# Altium project WIoT-WiFi_Shield.PrjPcb
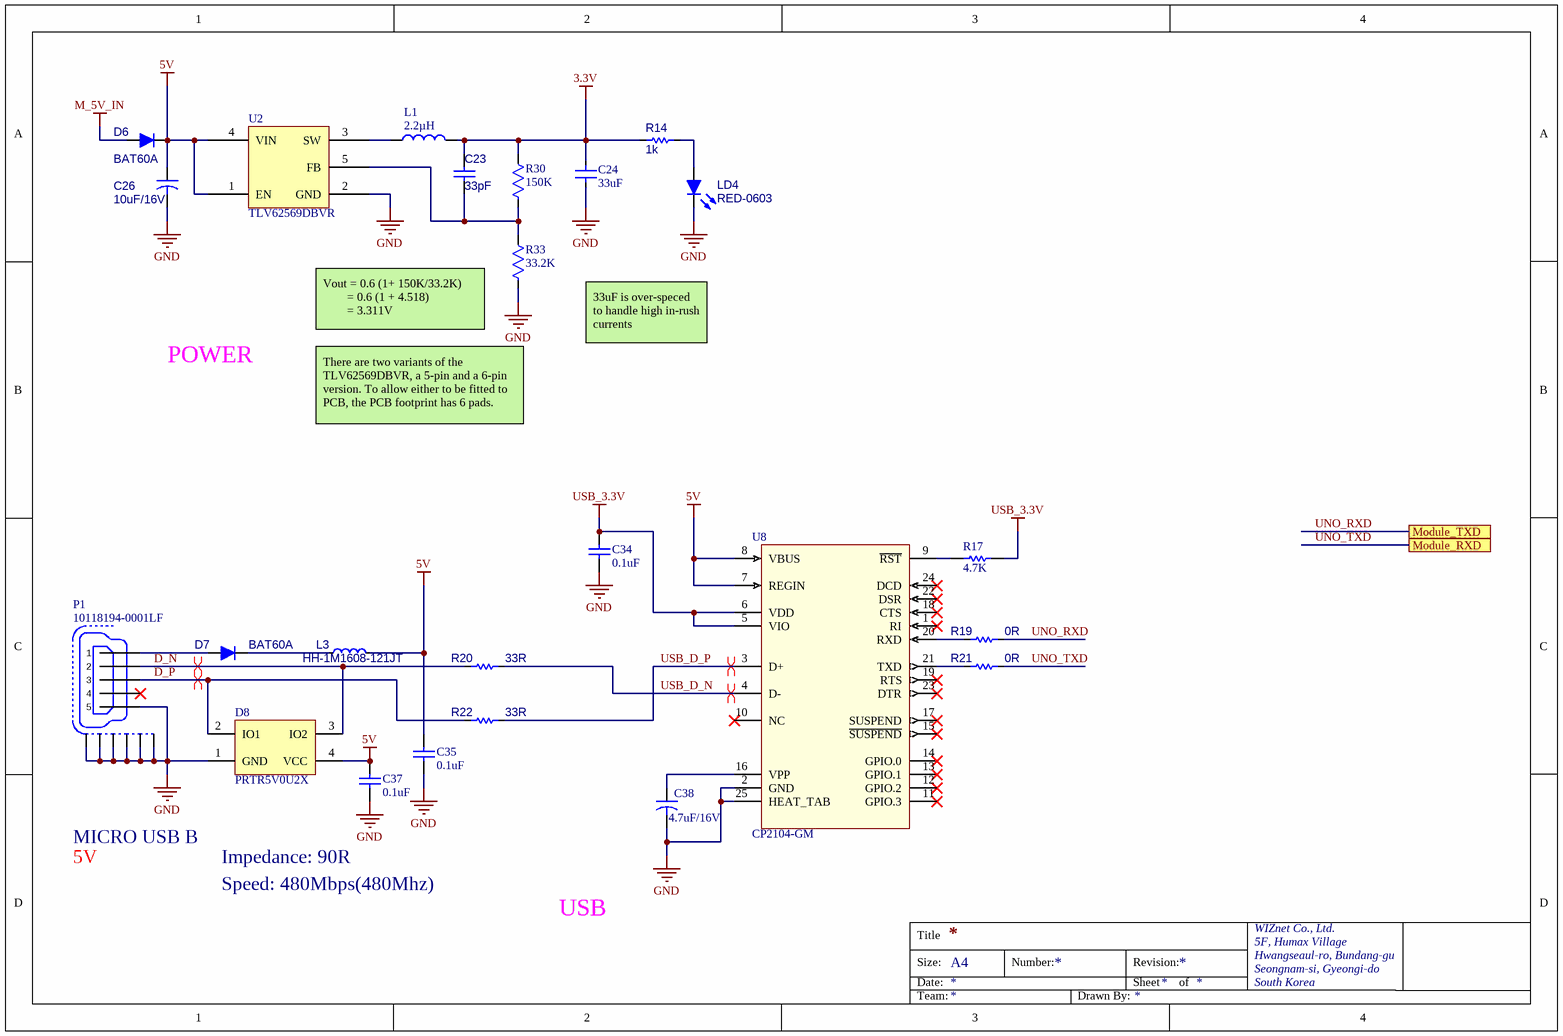
[diagram p0: 1.WiFi_POWER.SchDoc]
2 sheets, 55 parts. Net scope: flat (ports and power ports of the same name join across sheets).
Board file: WIoT-WiFi_shield.PcbDoc
Sheets:
  1.WiFi_POWER.SchDoc
  2.WiFi_Arduino Pinout.SchDoc

## Sheet 1.WiFi_POWER.SchDoc
size A4

### Parts
C23  33pF  [CAP-0402]
C24  33uF  [CAP-0805]
C26  10uF/16V  [CAP-A Size]
C34  0.1uF  [CAP-0402]
C35  0.1uF  [CAP-0402]
C37  0.1uF  [CAP-0402]
C38  4.7uF/16V  [CAP-A Size]
D6  BAT60A  [SOD-323(1-C,2-A)]
D7  BAT60A  [SOD-323(1-C,2-A)]
D8  PRTR5V0U2X  [SOT-143]
L1  2.2µH  [NR3015]
L3  HH-1M1608-121JT  [IND-0603]
LD4  RED-0603  [LED-0603-RED]
P1  10118194-0001LF  [USB-FCI-10118194]
R14  1k  [RES-0402]
R17  4.7K  [RES-0402]
R19  0R  [RES-0402]
R20  33R  [RES-0402]
R21  0R  [RES-0402]
R22  33R  [RES-0402]
R30  150K  [RES-0402]
R33  33.2K  [RES-0402]
U2  TLV62569DBVR  [SOT-23-5L]
U8  CP2104-GM  [QFN24(0.5/4X4)]

### Ports
Module_RXD, Module_TXD

### Nets
3.3V: C23.2 C24.2 L1.2 R14.1 R30.1
5V: C26.1 C35.2 C37.2 D6.1(K) D8.4(VCC) L3.2 U2.1(EN) U2.4(VIN) U8.7(REGIN) U8.8(VBUS)
GND: C24.1 C26.2 C34.1 C35.1 C37.1 C38.2 D8.1(GND) LD4.2(K) P1.5 P1.6 P1.7 P1.8 P1.9 P1.10 P1.11 R33.2 U2.2(GND) U8.2(GND) U8.25(HEAT_TAB)
M_5V_IN: D6.2(A)
USB_3.3V: C34.2 R17.2 U8.5(VIO) U8.6(VDD)
D_N: D8.3(IO2) P1.2 R20.2
D_P: D8.2(IO1) P1.3 R22.2
UNO_RXD: R19.1 ; port Module_TXD  [project net Module_TXD1]
UNO_TXD: R21.1 ; port Module_RXD  [project net Module_RXD1]
USB_D_N: R20.1 U8.4(D-)
USB_D_P: R22.1 U8.3(D+)
NetC23_1: C23.1 R30.2 R33.1 U2.5(FB)
NetC38_1: C38.1 U8.16(VPP)
NetD7_1: D7.1(K) L3.1
NetD7_2: D7.2(A) P1.1
NetL1_1: L1.1 U2.3(SW)
NetLD4_1: LD4.1(A) R14.2
NetR17_1: R17.1 U8.9(~{RST})
NetR19_2: R19.2 U8.20(RXD)
NetR21_2: R21.2 U8.21(TXD)

Not connected (* = marked no-connect by the designer): P1 4*; U8 1(RI)* 10(NC)* 11(GPIO.3)* 12(GPIO.2)* 13(GPIO.1)* 14(GPIO.0)* 15(~{SUSPEND})* 17(SUSPEND)* 18(CTS)* 19(RTS)* 22(DSR)* 23(DTR)* 24(DCD)*

### Layout directives
differential pair: D_N, D_P, USB_D_N, USB_D_P

### Notes on the sheet
- POWER
- (near R33) Vout = 0.6 (1+ 150K/33.2K)
  = 0.6 (1 + 4.518)
  = 3.311V
- 33uF is over-speced to handle high in-rush currents
- There are two variants of the TLV62569DBVR, a 5-pin and a 6-pin version. To allow either to be fitted to PCB, the PCB footprint has 6 pads.
- MICRO USB B
- 5V
- Impedance: 90R
- Speed: 480Mbps(480Mhz)
- USB
- Title
- Size:
- Date:
- A4
- Number:
- Revision:
- Sheet
- of
- WIZnet Co., Ltd.
- 5F, Humax Village
- Hwangseaul-ro, Bundang-gu
- Seongnam-si, Gyeongi-do
- South Korea
- Team:
- Drawn By:

### Library data of the parts
C23 C34 C35 C37 = CAP-0402: Ceramic CAP 0402(1005)
C24 = 33uF 0805 X5R 6.3V: 0805 10V 33uF X5R 20%; Manufacturer: TDK; Manufacturer Part Number: C2012X5R0J336M125AC; Dielectric Material: Ceramic; Voltage Rating (DC): 6.3V; Supplier 1: Digi-Key; Stock 1: 11984; Pricing 1: 1=0.87, 10=0.658, 100=0.4706, 500=0.3643, 1000=0.3137 (USD); Mount: Surface Mount; Case/Package: 0805; Weight: 0.000194oz; Case Code (Imperial): 0805; Case Code (Metric): 2012; Min Operating Temperature: -55°C; Max Operating Temperature: 85°C; Capacitance: 33uF; Tolerance: 20%; Packaging: Tape and Reel; Package Quantity: 1; Voltage Rating: 6.3V; Dielectric: X5R; Termination: SMD/SMT; Composition: Ceramic; Length: 2mm; Height: 1.25mm; Width: 1.2mm; Thickness: 0.057inch; Depth: 1.25mm; Radiation Hardening: No; REACH SVHC: No SVHC; Lead Free: Lead Free; ComponentLink1URL: https://datasheet.ciiva.com/24217/c2012x5r0j336m125ac-265107-24217265.pdf; ComponentLink1Description: https://datasheet.ciiva.com/24217/c2012x5r0j336m125ac-265107-24217265.pdf; ComponentLink2URL: https://datasheet.ciiva.com/17487/e412-c-17487404.pdf; ComponentLink2Description: https://datasheet.ciiva.com/17487/e412-c-17487404.pdf; ComponentLink3URL: https://datasheet.ciiva.com/6285/tdkmlcccaprange-6285867.pdf; ComponentLink3Description: https://datasheet.ciiva.com/6285/tdkmlcccaprange-6285867.pdf; ComponentLink4URL: https://datasheet.ciiva.com/6285/tdkmlcccaprange-6285863.pdf; ComponentLink4Description: https://datasheet.ciiva.com/6285/tdkmlcccaprange-6285863.pdf; Supplier Part Number 1: 445-5986-6-ND
C26 = CAP-A Size: Tantal CAP A Size EIA/IECQ 3216
C38 = CAP-A Size: Tantla CAP A Size EIA/IECQ 3216
D6 D7 = DIODE-BAT60A: Silicon Schottky Diode
D8 = PRTR5V0U2X: Ultra low capacitance double rail-to-rail ESD protection diode; Manufacturer: NXP; 2nd source part number: 152-4157; Artikkelnr Noca: 10069015; Artikkelnr Simpro: N.A.; Part Number: PRTR5V0U2X; Manufacturer Part Number: PRTR5V0U2X; Datasheet: http://www.farnell.com/datasheets/109718.pdf; LatestRevisionDate: 2012-06-11; Publisher: Nordic Semiconductor; Published: 2012-06-11; Value: PRTR5V0U2X; Note: *; Supplier: Digi-Key; Supplier part number: 568-4140-1-ND; 2nd source Supplier: Farnell; Footprint Doc: SOT-143B
L1 = NR3015T2R2M: FIXED IND 2.2UH 1.5A 72 MOHM SMD; Manufacturer: Taiyo Yuden; Type: Wirewound; Material - Core: Ferrite; Tolerance: ±20%; Current - Saturation: 1.48A; Shielding: Shielded; DC Resistance (DCR): 72 mOhm Max; Frequency - Self Resonant: 64MHz; Frequency - Test: 100kHz; Supplier 1: Digi-Key; Manufacturer Part Number: NR3015T2R2M; RoHS: RoHS Compliant; Category: Inductors, Coils, Chokes; Stock 1: 150589; Pricing 1: 1=0.23, 10=0.209, 25=0.1864, 50=0.163, 100=0.1513, 250=0.13964, 500=0.13268, 1000=0.10707 (GBP); Packaging: Cut Tape (CT); Inductance: 2.2µH; Current Rating: 1.5A; Q @ Freq: -; Ratings: -; Operating Temperature: -25°C ~ 120°C; Mounting Type: Surface Mount; Package / Case: Nonstandard; Size / Dimension: 0.118" L x 0.118" W (3.00mm x 3.00mm); Height - Seated (Max): 0.059" (1.50mm); ComponentLink1URL: http://ds.yuden.co.jp/TYCOMPAS/ut/detail.do?productNo=NR3015T2R2M&fileName=NR3015T2R2M_SS&mode=specSheetDownload; ComponentLink1Description: http://ds.yuden.co.jp/TYCOMPAS/ut/detail.do?productNo=NR3015T2R2M&fileName=NR3015T2R2M_SS&mode=specSheetDownload; Supplier Part Number 1: 587-1648-1-ND
L3 = IND-0603: Inductor 0603(1608)
LD4 = LED-0603
P1 = 47346-0001: MICRO USB B Type
R14 R17 R19-R22 = RES-0402
R30 = 150K: RES 150K OHM 1/10W 1% 0402 SMD; Manufacturer: Panasonic Electronic Components; Manufacturer Part Number: ERJ-2RKF1503X; Power (Watts): 0.1W, 1/10W; Temperature Coefficient: ±100ppm/°C; Supplier 1: Digi-Key; Supplier Part Number 1: P150KLCT-ND; RoHS: RoHS Compliant; Category: Resistors; Stock 1: 330002; Pricing 1: 1=0.07, 50=0.0128, 100=0.0097, 250=0.0072, 500=0.00532, 1000=0.00355, 5000=0.0025 (GBP); Packaging: Cut Tape (CT); Tolerance: ±1%; Composition: Thick Film; Features: -; Package / Case: 0402 (1005 Metric); Supplier Device Package: 0402; Size / Dimension: 0.039" L x 0.020" W (1.00mm x 0.50mm); Height: 0.016" (0.40mm); Number of Terminations: 2; ComponentLink1URL: http://industrial.panasonic.com/www-cgi/jvcr13pz.cgi?E+PZ+3+AOA0002+ERJ2RKF1503X+7+WW; ComponentLink1Description: http://industrial.panasonic.com/www-cgi/jvcr13pz.cgi?E+PZ+3+AOA0002+ERJ2RKF1503X+7+WW; Resistance (Ohms): 150K
R33 = 33.2K: RES 33.2K OHM 1/10W 1% 0402 SMD; Manufacturer: Panasonic Electronic Components; Manufacturer Part Number: ERJ-2RKF3322X; Power (Watts): 0.1W, 1/10W; Temperature Coefficient: ±100ppm/°C; Supplier 1: Digi-Key; Supplier Part Number 1: P33.2KLCT-ND; RoHS: RoHS Compliant; Category: Resistors; Stock 1: 313628; Pricing 1: 1=0.07, 50=0.0128, 100=0.0097, 250=0.0072, 500=0.00532, 1000=0.00355, 5000=0.0025 (GBP); Packaging: Cut Tape (CT); Tolerance: ±1%; Composition: Thick Film; Features: -; Package / Case: 0402 (1005 Metric); Supplier Device Package: 0402; Size / Dimension: 0.039" L x 0.020" W (1.00mm x 0.50mm); Height: 0.016" (0.40mm); Number of Terminations: 2; ComponentLink1URL: http://industrial.panasonic.com/www-cgi/jvcr13pz.cgi?E+PZ+3+AOA0002+ERJ2RKF3322X+7+WW; ComponentLink1Description: http://industrial.panasonic.com/www-cgi/jvcr13pz.cgi?E+PZ+3+AOA0002+ERJ2RKF3322X+7+WW; Resistance (Ohms): 33.2K
U2 = TLV62569DBVR: Variable voltage buck converter; Manufacturer: Texas Instruments; Supplier 1: Digi-Key; Manufacturer Part Number: TLV62569DBVR; Stock 1: 4987; Pricing 1: 1=1.32, 10=1.176, 100=0.9168, 500=0.75736, 1000=0.59792 (USD); Case/Package: SOT-23-5; Min Operating Temperature: -40°C; Max Operating Temperature: 125°C; Supplier Part Number 1: 296-47360-6-ND
U8 = CP2104-GM: USB to UART Bridge, SiliconLabs; RefDes: RefDes; Type: Type; Value: Value

## Sheet 2.WiFi_Arduino Pinout.SchDoc
size A4
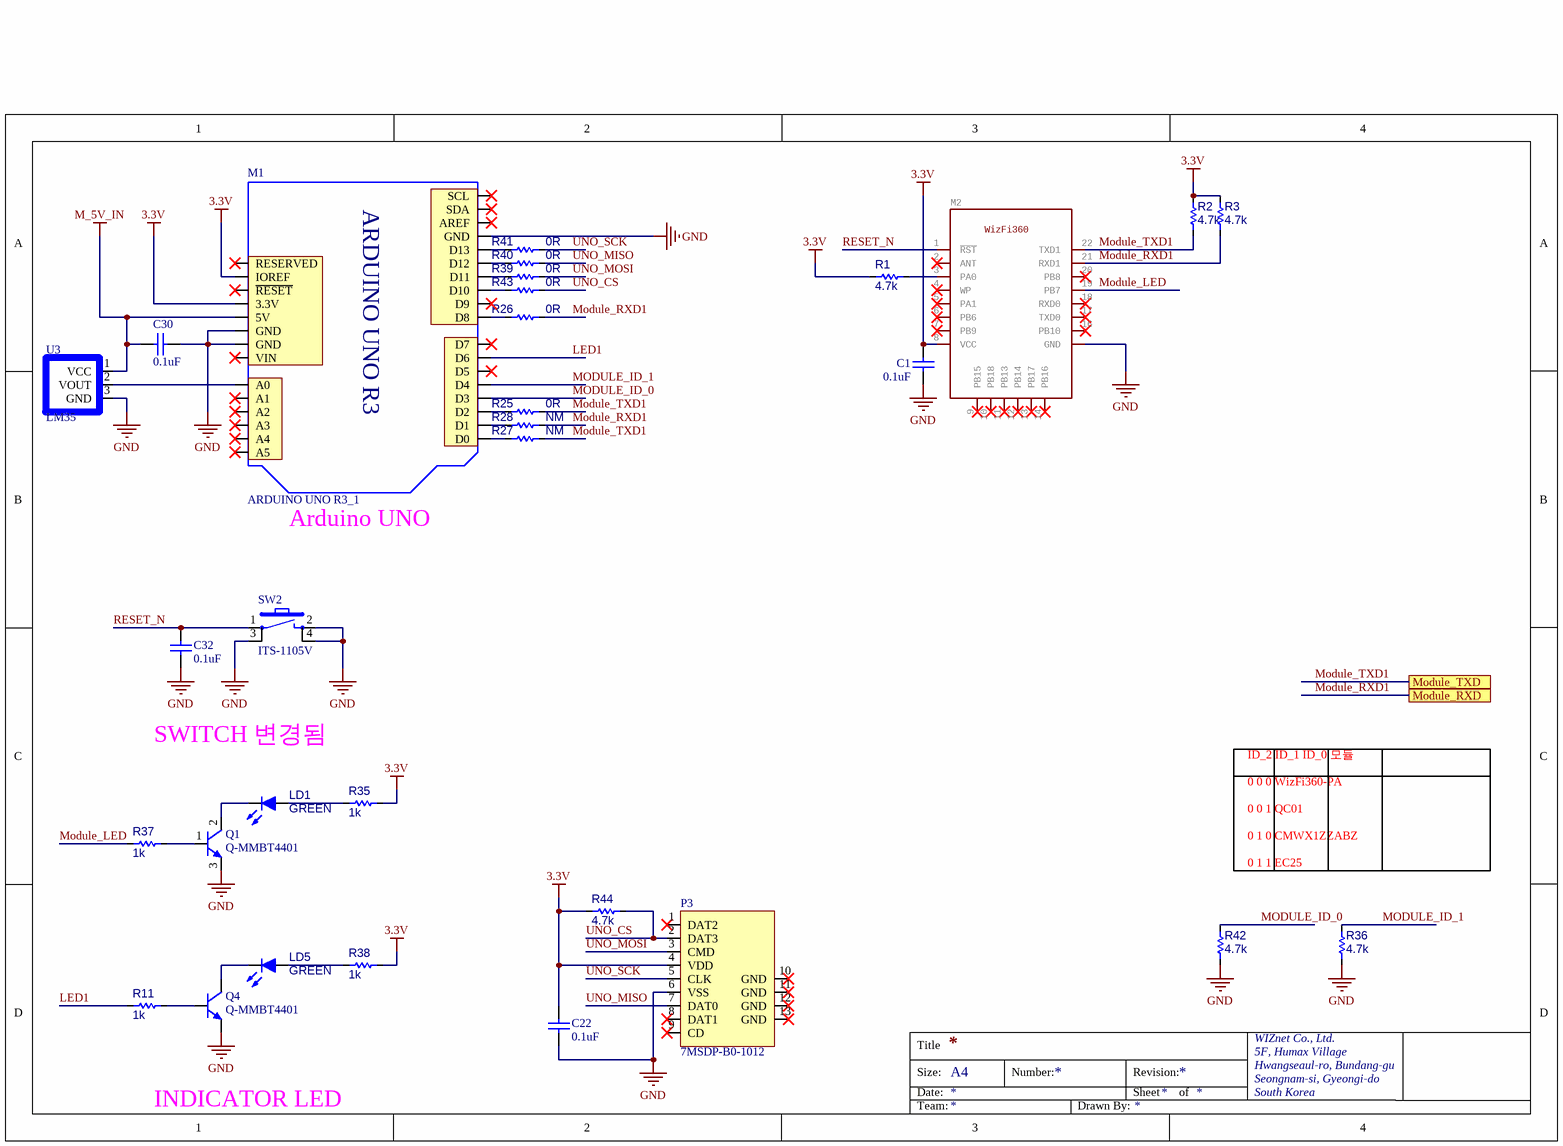
[diagram p1: 2.WiFi_Arduino Pinout.SchDoc]

### Parts
C1  0.1uF  [CAP-0402]
C22  0.1uF  [CAP-0402]
C30  0.1uF  [CAP-0402]
C32  0.1uF  [CAP-0402]
LD1  GREEN  [LED-0603-GREEN]
LD5  GREEN  [LED-0603-GREEN]
M1  ARDUINO UNO R3_1  [ARDUINOR3_ICSP(3)]
M2  WIZFI360  [WizFi360-PA]
P3  7MSDP-B0-1012  [7MSDP-B0-1012]
Q1  Q-MMBT4401  [SOT-23-3LL]
Q4  Q-MMBT4401  [SOT-23-3LL]
R1  4.7k  [RES-0402]
R2  4.7k  [RES-0402]
R3  4.7k  [RES-0402]
R11  1k  [RES-0402]
R25  0R  [RES-0402]
R26  0R  [RES-0402]
R27  NM  [RES-0402]
R28  NM  [RES-0402]
R35  1k  [RES-0402]
R36  4.7k  [RES-0402]
R37  1k  [RES-0402]
R38  1k  [RES-0402]
R39  0R  [RES-0402]
R40  0R  [RES-0402]
R41  0R  [RES-0402]
R42  4.7k  [RES-0402]
R43  0R  [RES-0402]
R44  4.7k  [RES-0402]
SW2  ITS-1105V  [ITS-1105V(DIP)]
U3  LM35  [TO-92]

### Ports
Module_RXD, Module_TXD

### Nets
3.3V: C1.2 C22.1 M1.3.3V M1.IOREF M2.8(VCC) P3.4(VDD) R1.2 R2.1 R3.1 R35.2 R38.2 R44.2
GND: C1.1 C22.2 C30.1 C32.1 M1.GND1(GND) M1.GND2(GND) M1.GND4(GND) M2.15_23_24(GND) P3.6(VSS) Q1.3(E) Q4.3(E) R36.1 R42.1 SW2.2 SW2.3(GND) SW2.4(GND) U3.3(GND)
M_5V_IN: C30.2 M1.5V U3.1(VCC)
LED1: M1.D6 R11.1
MODULE_ID_0: M1.D3 R42.2
MODULE_ID_1: M1.D4 R36.2
Module_LED: M2.19(PB7) R37.1
Module_RXD1: M2.21(RXD1) R3.2 R26.1 R28.1 ; port Module_RXD
Module_TXD1: M2.22(TXD1) R2.2 R25.1 R27.1 ; port Module_TXD
RESET_N: C32.2 M2.1(~{RST}) SW2.1
UNO_CS: P3.2(DAT3) R43.1 R44.1
UNO_MISO: P3.7(DAT0) R40.1
UNO_MOSI: P3.3(CMD) R39.1
UNO_SCK: P3.5(CLK) R41.1
NetLD1_1: LD1.1(A) R35.1
NetLD1_2: LD1.2(K) Q1.2(C)
NetLD5_1: LD5.1(A) R38.1
NetLD5_2: LD5.2(K) Q4.2(C)
NetM1_A0: M1.A0 U3.2(VOUT)
NetM1_D0: M1.D0 R27.2
NetM1_D1: M1.D1 R28.2
NetM1_D2: M1.D2 R25.2
NetM1_D8: M1.D8 R26.2
NetM1_D10: M1.D10 R43.2
NetM1_D11: M1.D11 R39.2
NetM1_D12: M1.D12 R40.2
NetM1_D13: M1.D13 R41.2
NetM2_3: M2.3(PA0) R1.1
NetQ1_1: Q1.1(B) R37.2
NetQ4_1: Q4.1(B) R11.2

Not connected (* = marked no-connect by the designer): M1 \RESET* A1* A2* A3* A4* A5* AREF* D5* D7* D9* RESERVED* SCL* SDA* VIN*; M2 2(ANT)* 4(WP)* 5(PA1)* 6(PB6)* 7(PB9)* 9(PB15)* 10(PB18)* 11(PB13)* 12(PB14)* 13(PB17)* 14(PB16)* 16(PB10)* 17(TXD0)* 18(RXD0)* 20(PB8)*; P3 1(DAT2)* 8(DAT1)* 9(CD)* 10(GND)* 11(GND)* 12(GND)* 13(GND)*

### Notes on the sheet
- Arduino UNO
- SWITCH 변경됨
- ID_2	ID_1	ID_0	모듈
- 0	0	0	WizFi360-PA
- 0	0	1	QC01
- 0	1	0	CMWX1ZZABZ
- 0	1	1	EC25
- INDICATOR LED
- Title
- Size:
- Date:
- A4
- Number:
- Revision:
- Sheet
- of
- WIZnet Co., Ltd.
- 5F, Humax Village
- Hwangseaul-ro, Bundang-gu
- Seongnam-si, Gyeongi-do
- South Korea
- Team:
- Drawn By:
- (in symbol ARDUINO UNO R3_1) ARDUINO UNO R3

### Library data of the parts
C1 C22 C30 C32 = CAP-0402: Ceramic CAP 0402(1005)
LD1 LD5 = LED-0603
M1 = ARDUINO UNO R3_1: Arduino UNO R3
M2 = WIZFI360: GateName_1: G$1; SymbolName_1: WIZFI360; LibraryName: WIZnet; DeviceSetName: WIZFI360; WizFi360: WizFi360
P3 = 7MSDP-B0-1012: Micro SD Card Socket
Q1 Q4 = Q-MMBT4401: NPN General-Purpose Amplifier
R1-R3 R11 R25-R28 R35-R44 = RES-0402
SW2 = SWITCH-ANGLE_TACT: Angle TACT SW, SMD

## Nets that join several sheets
3.3V: 1.WiFi_POWER (5 pins), 2.WiFi_Arduino Pinout (12 pins)
GND: 1.WiFi_POWER (19 pins), 2.WiFi_Arduino Pinout (17 pins)
M_5V_IN: 1.WiFi_POWER (D6.2), 2.WiFi_Arduino Pinout (C30.2 M1.5V U3.1)
Module_RXD1: 1.WiFi_POWER (R21.1), 2.WiFi_Arduino Pinout (M2.21 R3.2 R26.1 R28.1)
Module_TXD1: 1.WiFi_POWER (R19.1), 2.WiFi_Arduino Pinout (M2.22 R2.2 R25.1 R27.1)